# EAGLE schematic cs_v1 (EAGLE 9.5.0)

## Sheet 1 of 4
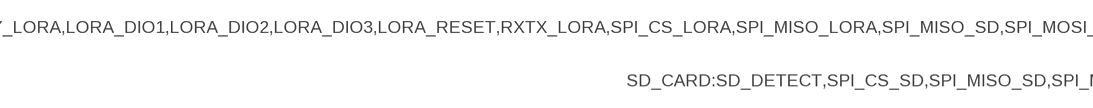
[diagram p0: schematic, sheet 1, part 1 of 2]
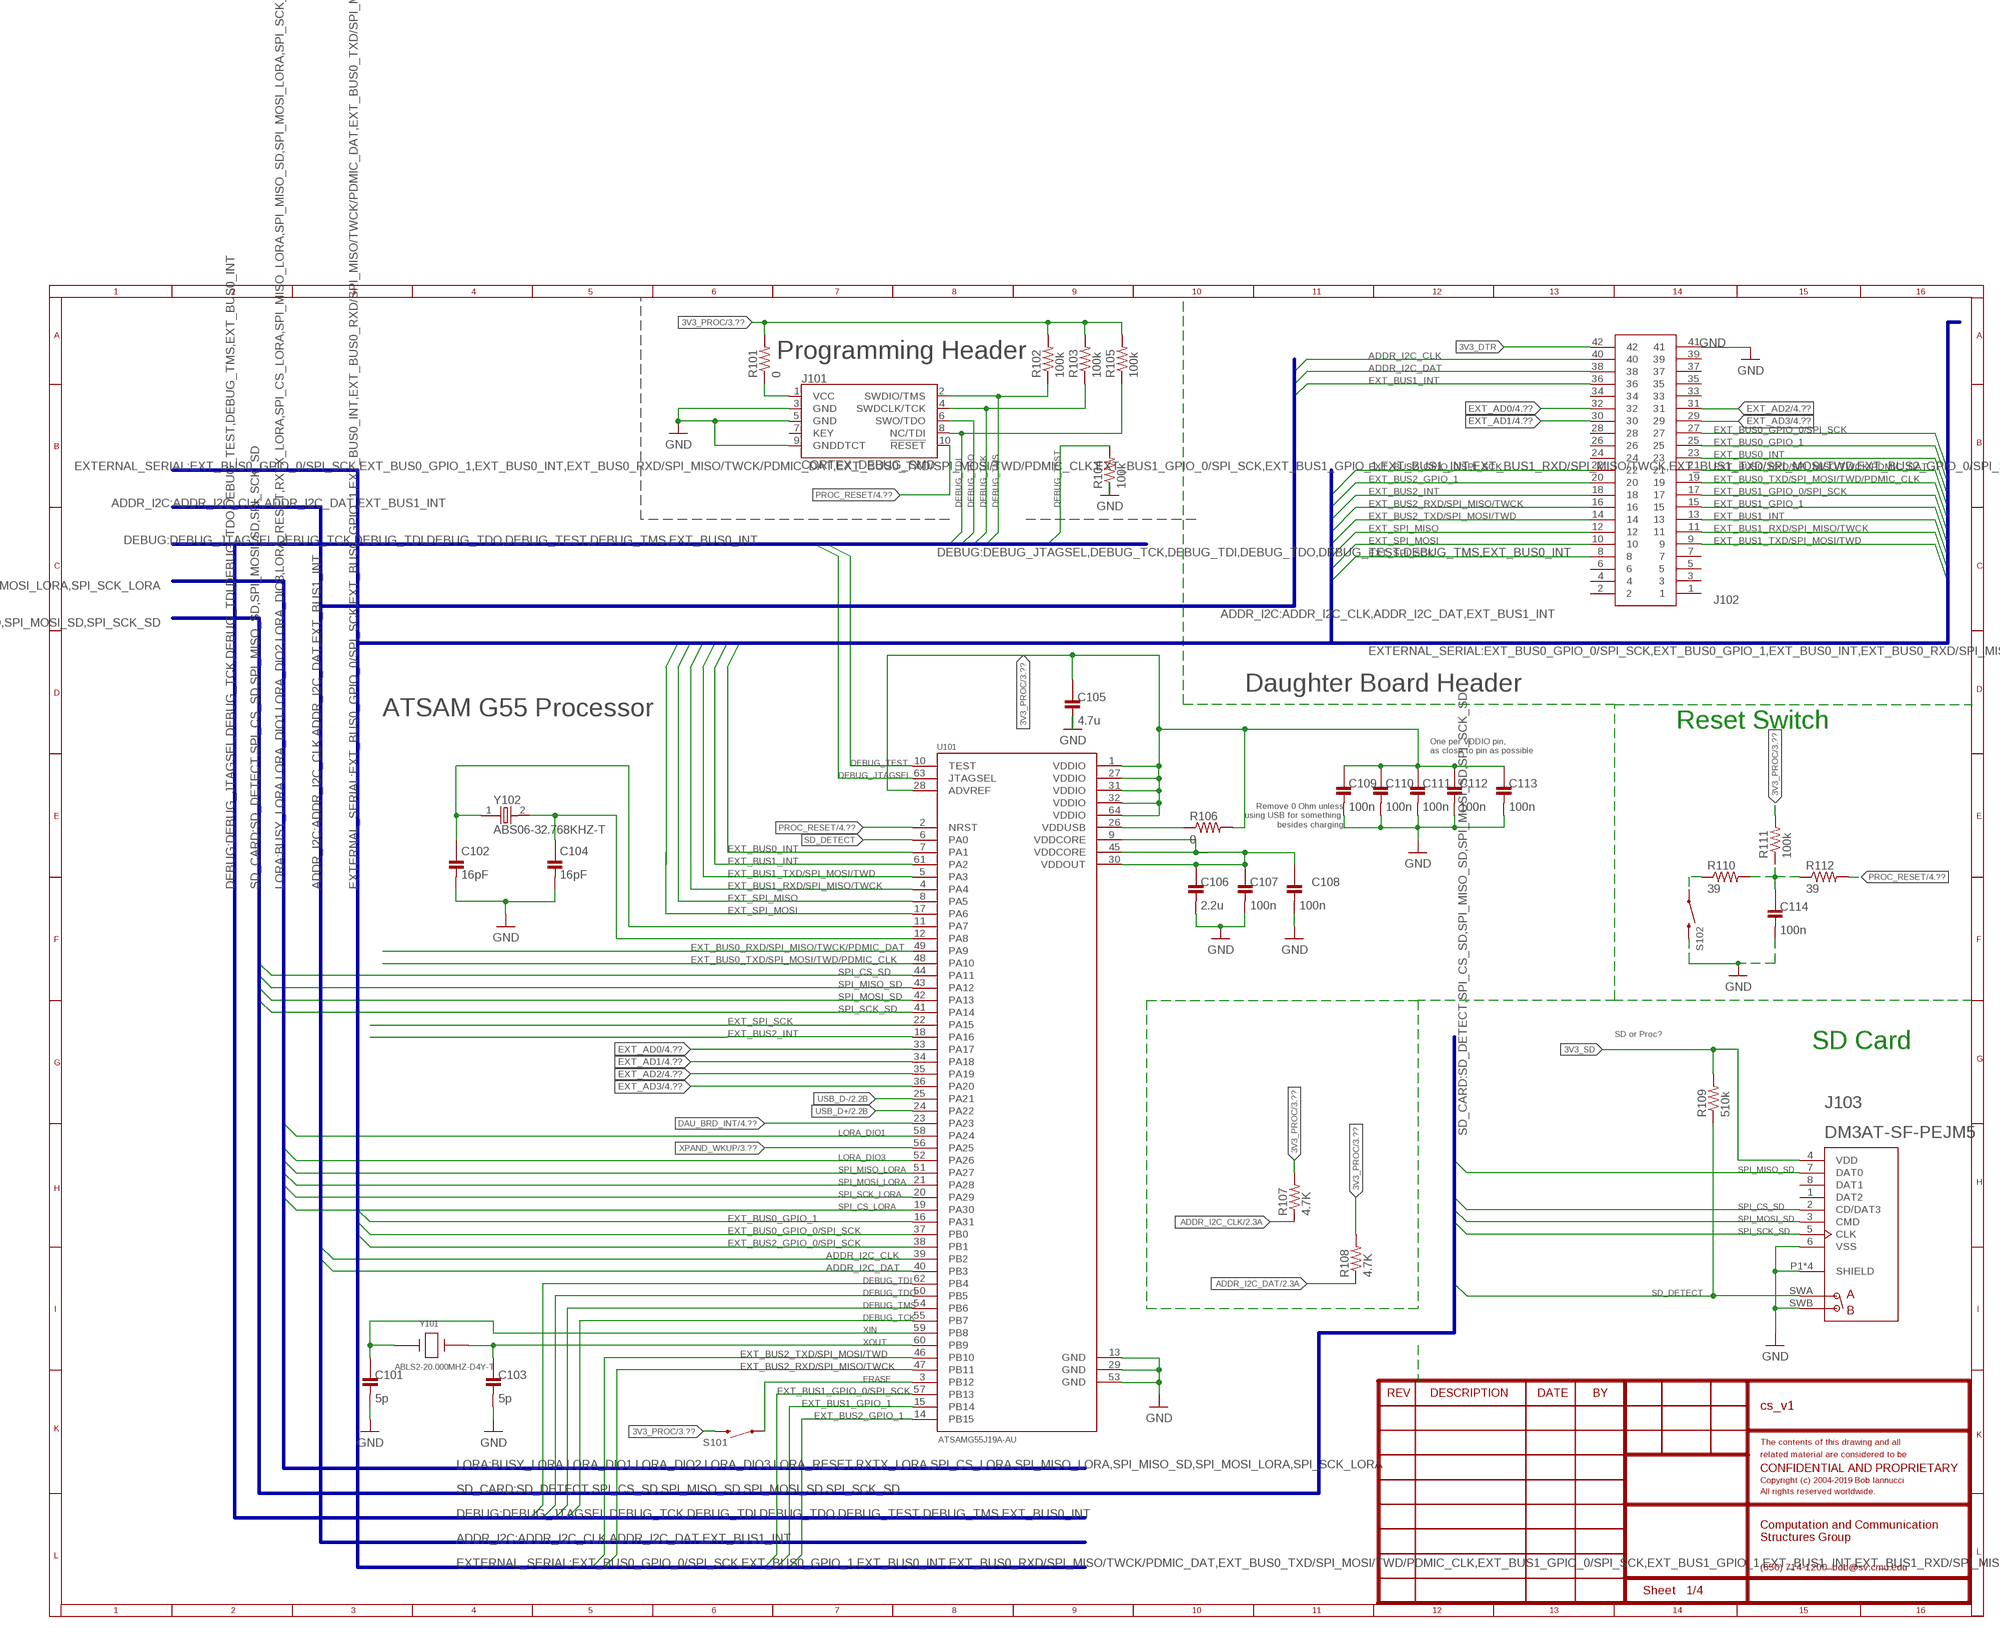
[diagram p1: schematic, sheet 1, part 2 of 2]

### Parts
C101  5p  C-0402  [C0402]
C102  16pF  C-0402  [C0402]
C103  5p  C-0402  [C0402]
C104  16pF  C-0402  [C0402]
C105  4.7u  C-0402  [C0402]
C106  2.2u  C-0402  [C0402]
C107  100n  C-0402  [C0402]
C108  100n  C-0402  [C0402]
C109  100n  C-0402  [C0402]
C110  100n  C-0402  [C0402]
C111  100n  C-0402  [C0402]
C112  100n  C-0402  [C0402]
C113  100n  C-0402  [C0402]
C114  100n  C-0402  [C0402]
J101  CORTEX_DEBUG_SMD  [SAMTECH_FTSH-105-01]
J102  HIROSE-DF17(4.0)-40DS-0.5V(57)  [DF174040DS05V57_1]
J103  DM3AT-SF-PEJM5  [HRS_DM3AT-SF-PEJM5]
R101  0  0OHM-0603-1/10W  [0603]
R102  100k  R-0402  [R0402]
R103  100k  R-0402  [R0402]
R104  100k  R-0402  [R0402]
R105  100k  R-0402  [R0402]
R106  0  0OHM-0603-1/10W  [0603]
R107  4.7K  R-0402  [R0402]
R108  4.7K  R-0402  [R0402]
R109  510k  R-0402  [R0402]
R110  39  R-0402  [R0402]
R111  100k  R-0402  [R0402]
R112  39  R-0402  [R0402]
S101  MOMENTARY-SWITCH-SPST-SMD-5.2-REDUNDANT  [TACTILE_SWITCH_SMD_5.2MM]
S102  MOMENTARY-SWITCH-SPST-SMD-5.2-REDUNDANT  [TACTILE_SWITCH_SMD_5.2MM]
U101  ATSAMG55J19A-AU  [QFP50P1200X1200X160-64N]
Y101  ABLS2-20.000MHZ-D4Y-T  [XTAL_ABLS2-20.000MHZ-D4Y-T]
Y102  ABS06-32.768KHZ-T  [XTAL_ABS06-32.768KHZ-T]

### Nets
3V3_DTR [power_3v3]: J102.42 ; also sheet 2,4
3V3_PROC [power_3v3]: C105.1 C109.1 C110.1 C111.1 C112.1 C113.1 R101.2 R102.2 R103.2 R105.2 R106.2 R107.2 R108.2 R111.2 S101.3 S101.4 U101.1(VDDIO) U101.27(VDDIO) U101.28(ADVREF) U101.31(VDDIO) U101.32(VDDIO) U101.64(VDDIO) ; also sheet 2,3,4
3V3_SD [power_3v3]: J103.4(VDD) R109.2 ; also sheet 2,4
ADDR_I2C_CLK: J102.40 R107.1 U101.39(PB2) ; also sheet 2,3,4
ADDR_I2C_DAT: J102.38 R108.1 U101.40(PB3) ; also sheet 2,3,4
DAU_BRD_INT: U101.23(PA23) ; also sheet 4
DEBUG_JTAGSEL: U101.63(JTAGSEL)
DEBUG_TCK: J101.4(SWDCLK/TCK) R103.1 U101.55(PB7)
DEBUG_TDI: J101.8(NC/TDI) R105.1 U101.62(PB4)
DEBUG_TDO: J101.6(SWO/TDO) U101.50(PB5)
DEBUG_TEST: R104.2 U101.10(TEST)
DEBUG_TMS: J101.2(SWDIO/TMS) R102.1 U101.54(PB6)
ERASE: S101.1 S101.2 U101.3(PB12)
EXT_AD0: J102.32 U101.33(PA17) ; also sheet 4
EXT_AD1: J102.30 U101.34(PA18) ; also sheet 4
EXT_AD2: J102.31 U101.35(PA19) ; also sheet 4
EXT_AD3: J102.29 U101.36(PA20) ; also sheet 4
EXT_BUS0_GPIO_0/SPI_SCK: J102.27 U101.37(PB0) ; also sheet 4
EXT_BUS0_GPIO_1: J102.25 U101.16(PA31) ; also sheet 4
EXT_BUS0_INT: J102.23 U101.7(PA1) ; also sheet 4
EXT_BUS0_RXD/SPI_MISO/TWCK/PDMIC_DAT: J102.21 U101.49(PA9) ; also sheet 4
EXT_BUS0_TXD/SPI_MOSI/TWD/PDMIC_CLK: J102.19 U101.48(PA10) ; also sheet 4
EXT_BUS1_GPIO_0/SPI_SCK: J102.17 U101.57(PB13) ; also sheet 4
EXT_BUS1_GPIO_1: J102.15 U101.15(PB14) ; also sheet 4
EXT_BUS1_INT: J102.13 J102.36 U101.61(PA2) ; also sheet 4
EXT_BUS1_RXD/SPI_MISO/TWCK: J102.11 U101.4(PA4) ; also sheet 4
EXT_BUS1_TXD/SPI_MOSI/TWD: J102.9 U101.5(PA3) ; also sheet 4
EXT_BUS2_GPIO_0/SPI_SCK: J102.22 U101.38(PB1) ; also sheet 4
EXT_BUS2_GPIO_1: J102.20 U101.14(PB15) ; also sheet 4
EXT_BUS2_INT: J102.18 U101.18(PA16) ; also sheet 4
EXT_BUS2_RXD/SPI_MISO/TWCK: J102.16 U101.47(PB11) ; also sheet 4
EXT_BUS2_TXD/SPI_MOSI/TWD: J102.14 U101.46(PB10) ; also sheet 4
EXT_SPI_MISO: J102.12 U101.8(PA5) ; also sheet 4
EXT_SPI_MOSI: J102.10 U101.17(PA6) ; also sheet 4
EXT_SPI_SCK: J102.8 U101.22(PA15) ; also sheet 4
GND [10_mil]: C101.2 C102.2 C103.2 C104.2 C105.2 C106.2 C107.2 C108.2 C109.2 C110.2 C111.2 C112.2 C113.2 C114.2 J101.3(GND) J101.5(GND) J101.9(GNDDTCT) J102.41 J103.6(VSS) J103.P1(SHIELD) J103.P2(SHIELD) J103.P3(SHIELD) J103.P4(SHIELD) J103.SWB(B) R104.1 S102.3 S102.4 U101.13(GND) U101.29(GND) U101.53(GND) ; also sheet 2,3,4
LORA_DIO1: U101.58(PA24) ; also sheet 3,4
LORA_DIO3: U101.52(PA26) ; also sheet 3,4
N$4: J101.1(VCC) R101.1
PROC_RESET: J101.10(!RESET) R112.2 U101.2(NRST) ; also sheet 4
RESET_SW_1: C114.1 R110.2 R111.1 R112.1
RESET_SW_2: R110.1 S102.1 S102.2
SD_DETECT: J103.SWA(A) R109.1 U101.6(PA0) ; also sheet 4
SPI_CS_LORA: U101.19(PA30) ; also sheet 3,4
SPI_CS_SD: J103.2(CD/DAT3) U101.44(PA11) ; also sheet 4
SPI_MISO_LORA: U101.51(PA27) ; also sheet 3,4
SPI_MISO_SD: J103.7(DAT0) U101.43(PA12) ; also sheet 4
SPI_MOSI_LORA: U101.21(PA28) ; also sheet 3,4
SPI_MOSI_SD: J103.3(CMD) U101.42(PA13) ; also sheet 4
SPI_SCK_LORA: U101.20(PA29) ; also sheet 3,4
SPI_SCK_SD: J103.5(CLK) U101.41(PA14) ; also sheet 4
USB_D+: U101.24(PA22) ; also sheet 2,4
USB_D-: U101.25(PA21) ; also sheet 2,4
VDDOUT [power_3v3]: C106.1 C107.1 C108.1 U101.9(VDDCORE) U101.30(VDDOUT) U101.45(VDDCORE)
VDDUSB [power_3v3]: R106.1 U101.26(VDDUSB)
XIN: C101.1 U101.59(PB8) Y101.1
XIN32: C102.1 U101.11(PA7) Y102.1
XOUT: C103.1 U101.60(PB9) Y101.2
XOUT32: C104.1 U101.12(PA8) Y102.2
XPAND_WKUP: U101.56(PA25) ; also sheet 3,4
Unconnected: J101.7(KEY) J102.1 J102.2 J102.3 J102.4 J102.5 J102.6 J102.7 J102.24 J102.26 J102.28 J102.33 J102.34 J102.35 J102.37 J102.39 J103.1(DAT2) J103.8(DAT1)

### Buses
SD_CARD:SD_DETECT,SPI_CS_SD,SPI_MISO_SD,SPI_MOSI_SD,SPI_SCK_SD
LORA:BUSY_LORA,LORA_DIO1,LORA_DIO2,LORA_DIO3,LORA_RESET,RXTX_LORA,SPI_CS_LORA,SPI_MISO_LORA,SPI_MISO_SD,SPI_MOSI_LORA,SPI_SCK_LORA
DEBUG:DEBUG_JTAGSEL,DEBUG_TCK,DEBUG_TDI,DEBUG_TDO,DEBUG_TEST,DEBUG_TMS,EXT_BUS0_INT
EXTERNAL_SERIAL:EXT_BUS0_GPIO_0/SPI_SCK,EXT_BUS0_GPIO_1,EXT_BUS0_INT,EXT_BUS0_RXD/SPI_MISO/TWCK/PDMIC_DAT,EXT_BUS0_TXD/SPI_MOSI/TWD/PDMIC_CLK,EXT_BUS1_GPIO_0/SPI_SCK,EXT_BUS1_GPIO_1,EXT_BUS1_INT,EXT_BUS1_RXD/SPI_MISO/TWCK,EXT_BUS1_TXD/SPI_MOSI/TWD,EXT_BUS2_GPIO_0/SPI_SCK,EXT_BUS2_GPIO_1,EXT_BUS2_INT,EXT_BUS2_RXD/SPI_MISO/TWCK,EXT_BUS2_TXD/SPI_MOSI/TWD,EXT_SPI_MISO,EXT_SPI_MOSI,EXT_SPI_SCK
ADDR_I2C:ADDR_I2C_CLK,ADDR_I2C_DAT,EXT_BUS1_INT

### Notes on the sheet
- Programming Header
- Daughter Board Header
- ATSAM G55 Processor
- Reset Switch
- One per VDDIO pin, 
  as close to pin as possible
- Remove 0 Ohm unless
  using USB for something 
  besides charging
- SD or Proc?
- SD Card

## Sheet 2 of 4
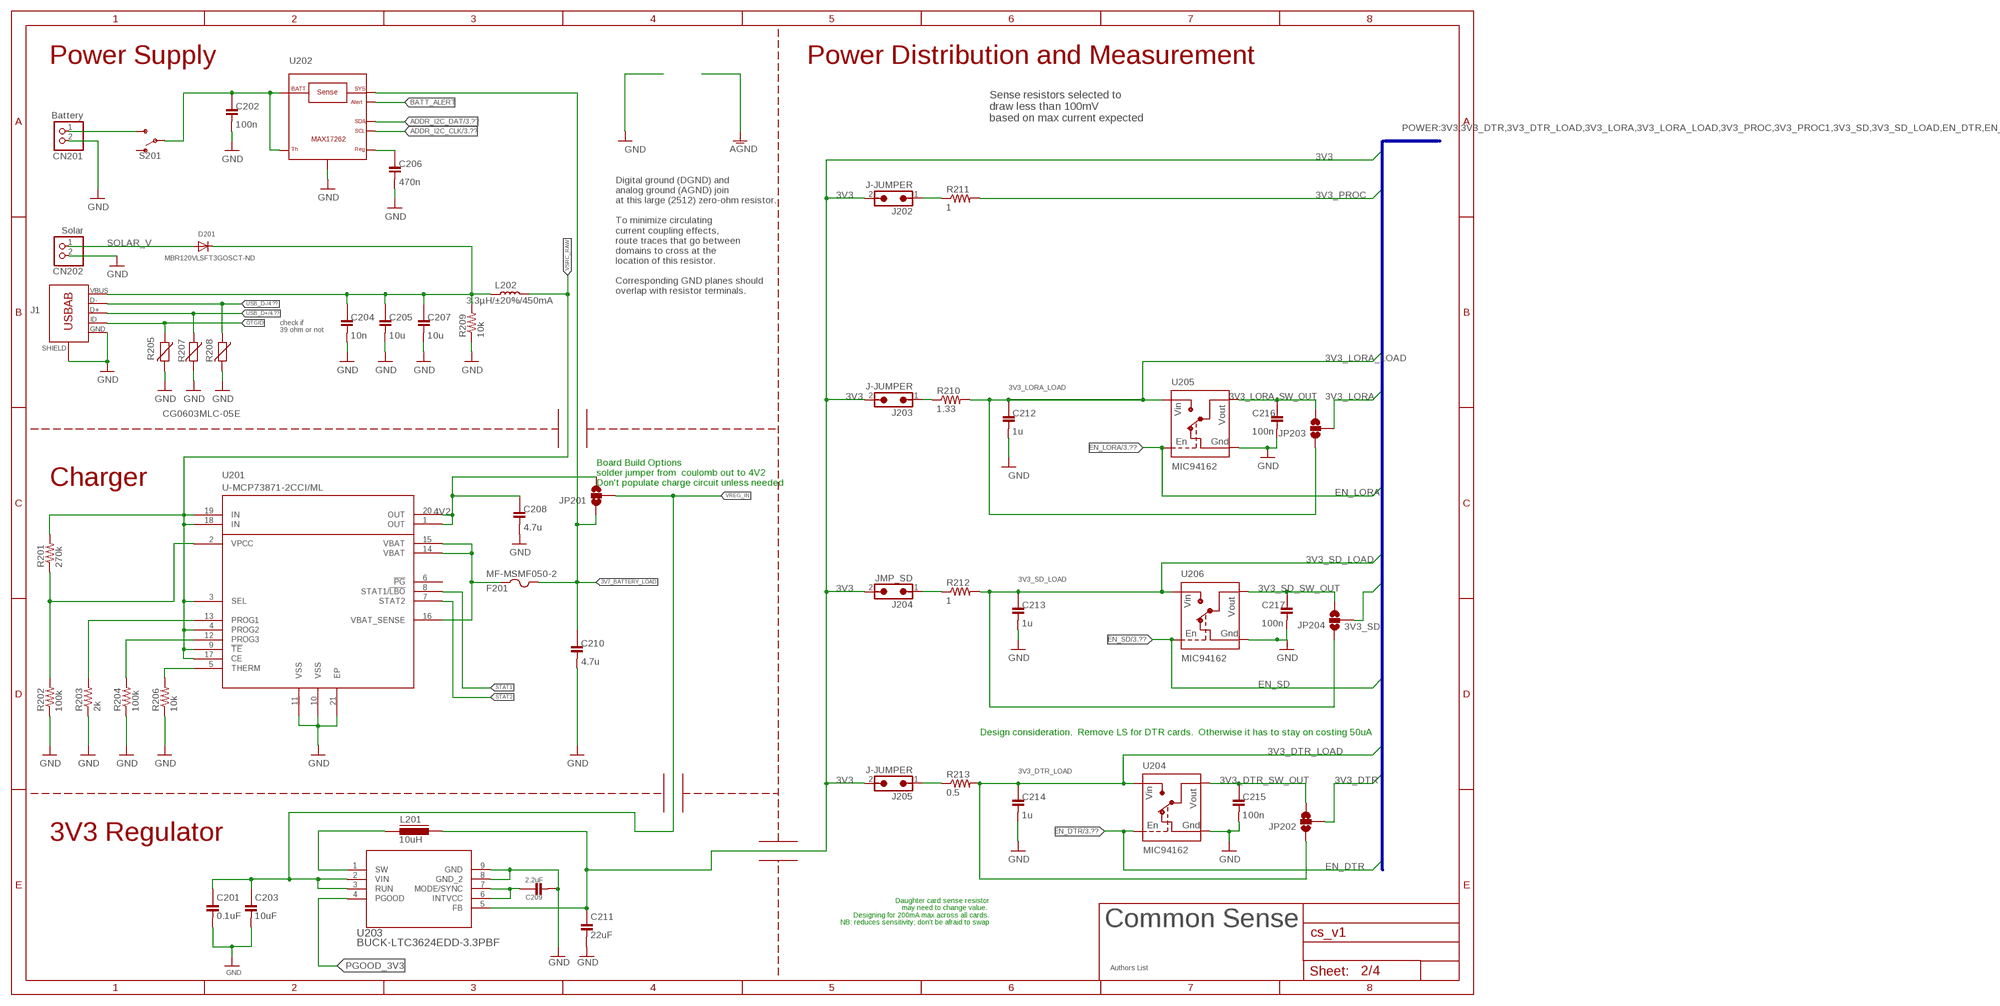
[diagram p2: schematic, sheet 2]

### Parts
C201  0.1uF  C-0603  [C0603]
C202  100n  C-0402  [C0402]
C203  10uF  C-0805  [C0805]
C204  10n  C-0402  [C0402]
C205  10u  C-0402  [C0402]
C206  470n  C-0402  [C0402]
C207  10u  C-0402  [C0402]
C208  4.7u  C-0402  [C0402]
C209  2.2uF  C-0805  [C0805]
C210  4.7u  C-0402  [C0402]
C211  22uF  C-0805  [C0805]
C212  1u  C-0402  [C0402]
C213  1u  C-0402  [C0402]
C214  1u  C-0402  [C0402]
C215  100n  C-0402  [C0402]
C216  100n  C-0402  [C0402]
C217  100n  C-0402  [C0402]
CN201  Battery  JST_2PIN-THM-RA  [JST-PH-2-THM-RA]
CN202  Solar  JST_2PIN-THM-RA  [JST-PH-2-THM-RA]
D201  MBR120VLSFT3GOSCT-ND  DIODESOD-123  [SOD-123]
F201  MF-MSMF050-2  PTCFUSE-1812  [1812]
J201  USBABSMTDIP  [ZX62D-AB-5P8]
J202  J-JUMPER  [HEADER-1X2]
J203  J-JUMPER  [HEADER-1X2]
J204  JMP_SD  J-JUMPER  [HEADER-1X2]
J205  J-JUMPER  [HEADER-1X2]
JP201  JMP_CHRG  JUMPER-SMT_3_NO_NO-SILK  [SMT-JUMPER_3_NO_NO-SILK]
JP202  JMP_DTR  JUMPER-SMT_3_NO_NO-SILK  [SMT-JUMPER_3_NO_NO-SILK]
JP203  JMP_LORA  JUMPER-SMT_3_NO_NO-SILK  [SMT-JUMPER_3_NO_NO-SILK]
JP204  JMP_SD  JUMPER-SMT_3_NO_NO-SILK  [SMT-JUMPER_3_NO_NO-SILK]
L201  10uH  L-FE-5X5SMD  [L-5X5SMD]
L202  3.3µH/±20%/450mA  INDUCTOR-0805-3.3UH  [0805]
R201  270k  R-0402  [R0402]
R202  100k  R-0402  [R0402]
R203  2k  R-0402  [R0402]
R204  100k  R-0402  [R0402]
R205  CG0603MLC-05E  VARISTORCN0603  [CT/CN0603]
R206  10k  R-0402  [R0402]
R207  CG0603MLC-05E  VARISTORCN0603  [CT/CN0603]
R208  CG0603MLC-05E  VARISTORCN0603  [CT/CN0603]
R209  10k  R-0402  [R0402]
R210  1.33  R-0603  [R0603]
R211  1  R-0603  [R0603]
R212  1  R-0603  [R0603]
R213  0.5  R-0603  [R0603]
S201  SWITCH-SPDT-SMD-RIGHT-ANGLE  [SWITCH_SPST_SMD_A]
U201  U-MCP73871-2CCI/ML  [QFN20_4X4MC]
U202  COULOMB-MAX17262  [BGA9N40P3X3_144X146X69N]
U203  BUCK-LTC3624EDD-3.3PBF  [DFN-8_DD]
U204  LOADSWITCH-MIC94162  [WLCSP6_2X3]
U205  LOADSWITCH-MIC94162  [WLCSP6_2X3]
U206  LOADSWITCH-MIC94162  [WLCSP6_2X3]

### Nets
3V3 [power_3v3]: C211.1 J202.2 J203.2 J204.2 J205.2 L201.2 U203.5(FB) ; also sheet 4
3V3_DTR [power_3v3]: JP202.2 ; also sheet 1,4
3V3_DTR_LOAD [power_3v3]: C214.1 JP202.1 R213.2 U204.A2(VIN) U204.B2(VIN) ; also sheet 4
3V3_DTR_SW_OUT [power_3v3]: C215.1 JP202.3 U204.A1(VOUT) U204.B1(VOUT)
3V3_LORA [power_3v3]: JP203.2 ; also sheet 3,4
3V3_LORA_LOAD [power_3v3]: C212.1 JP203.1 R210.2 U205.A2(VIN) U205.B2(VIN) ; also sheet 4
3V3_LORA_SW_OUT [power_3v3]: C216.1 JP203.3 U205.A1(VOUT) U205.B1(VOUT)
3V3_PROC [power_3v3]: R211.2 ; also sheet 1,3,4
3V3_SD [power_3v3]: JP204.2 ; also sheet 1,4
3V3_SD_LOAD [power_3v3]: C213.1 JP204.1 R212.2 U206.A2(VIN) U206.B2(VIN) ; also sheet 4
3V3_SD_SW_OUT [power_3v3]: C217.1 JP204.3 U206.A1(VOUT) U206.B1(VOUT)
3V7_BATTERY [power_3v3]: C202.1 S201.2(P) U202.A1(TH) U202.A2(BATT)
3V7_BATTERY_LOAD [power_3v3]: C210.1 F201.2 JP201.1 U202.B3(SYS)
4V2 [power_5]: C208.1 JP201.3 U201.1(OUT) U201.20(OUT)
ADDR_I2C_CLK: U202.B1(SCL) ; also sheet 1,3,4
ADDR_I2C_DAT: U202.C1(SDA) ; also sheet 1,3,4
BAT_CHG_PROG1: R203.2 U201.13(PROG1)
BATT_ALERT: U202.B2(ALRT)
BATT_IN [power_3v3]: CN201.1 S201.3(S)
CHG_VPCC [power_3v3]: R201.1 R202.2 U201.2(VPCC)
DTR_JMP [power_3v3]: J205.1 R213.1
EN_DTR: U204.C2(ENABLE) ; also sheet 3,4
EN_LORA: U205.C2(ENABLE) ; also sheet 3,4
EN_SD: U206.C2(ENABLE) ; also sheet 3,4
GND [10_mil]: C201.2 C202.2 C203.2 C204.2 C205.2 C206.2 C207.2 C208.2 C209.2 C210.2 C211.2 C212.2 C213.2 C214.2 C215.2 C216.2 C217.2 CN201.2 CN202.2 J201.GND J201.S1(SHIELD) J201.S2(SHIELD) J201.S3(SHIELD) J201.S4(SHIELD) R202.1 R203.1 R204.1 R205.2 R206.1 R207.2 R208.2 R209.1 U201.10(VSS) U201.11(VSS) U201.21(EP) U202.C3(GND) U203.8(GND_2) U203.9(GND) U204.C1(GND) U205.C1(GND) U206.C1(GND) ; also sheet 1,3,4
LORA_JMP [power_3v3]: J203.1 R210.1
N$2 [power_3v3]: L201.1 U203.1(SW)
N$8: C209.1 U203.6(INTVCC) U203.7(MODE/SYNC)
N$10: R204.2 U201.12(PROG3)
N$13: C206.1 U202.C2(REG)
OTGID: J201.USBID R205.1
PGOOD_3V3: U203.4(PGOOD)
PROC_JMP [power_3v3]: J202.1 R211.1
SD_JMP [power_3v3]: J204.1 R212.1
SOLAR_V [power_3v3]: CN202.1 D201.A
STAT1: U201.8(STAT1/!LBO)
STAT2: U201.7(STAT2)
THERM: R206.2 U201.5(THERM)
USB_D+: J201.D+ R207.1 ; also sheet 1,4
USB_D-: J201.D- R208.1 ; also sheet 1,4
USB_VBUS [power_3v3]: C204.1 C205.1 C207.1 D201.C J201.VBUS L202.1 R209.2
VBAT [power_3v3]: F201.1 U201.14(VBAT) U201.15(VBAT) U201.16(VBAT_SENSE)
VREG_IN [power_5]: C201.1 C203.1 JP201.2 U203.2(VIN) U203.3(RUN)
VSRC_RAW [power_3v3]: L202.2 R201.2 U201.3(SEL) U201.4(PROG2) U201.9(!TE) U201.17(CE) U201.18(IN) U201.19(IN)
Unconnected: S201.1(O) U201.6(!PG)

### Buses
POWER:3V3,3V3_DTR,3V3_DTR_LOAD,3V3_LORA,3V3_LORA_LOAD,3V3_PROC,3V3_PROC1,3V3_SD,3V3_SD_LOAD,EN_DTR,EN_LORA,EN_SD

### Notes on the sheet
- Power Supply | Power Distribution and Measurement
- Sense resistors selected to
  draw less than 100mV 
  based on max current expected
- Digital ground (DGND) and
  analog ground (AGND) join
  at this large (2512) zero-ohm resistor.
  
  To minimize circulating 
  current coupling effects,
  route traces that go between
  domains to cross at the 
  location of this resistor.
  
  Corresponding GND planes should 
  overlap with resistor terminals.
- J1
- check if 
  39 ohm or not
- Charger
- Board Build Options
  solder jumper from  coulomb out to 4V2
  Don't populate charge circuit unless needed
- Design consideration.  Remove LS for DTR cards.  Otherwise it has to stay on costing 50uA
- 3V3 Regulator
- Daughter card sense resistor
  may need to change value. 
  Designing for 200mA max across all cards.
  NB: reduces sensitivity; don't be afraid to swap
- Common Sense
- Authors List

## Sheet 3 of 4
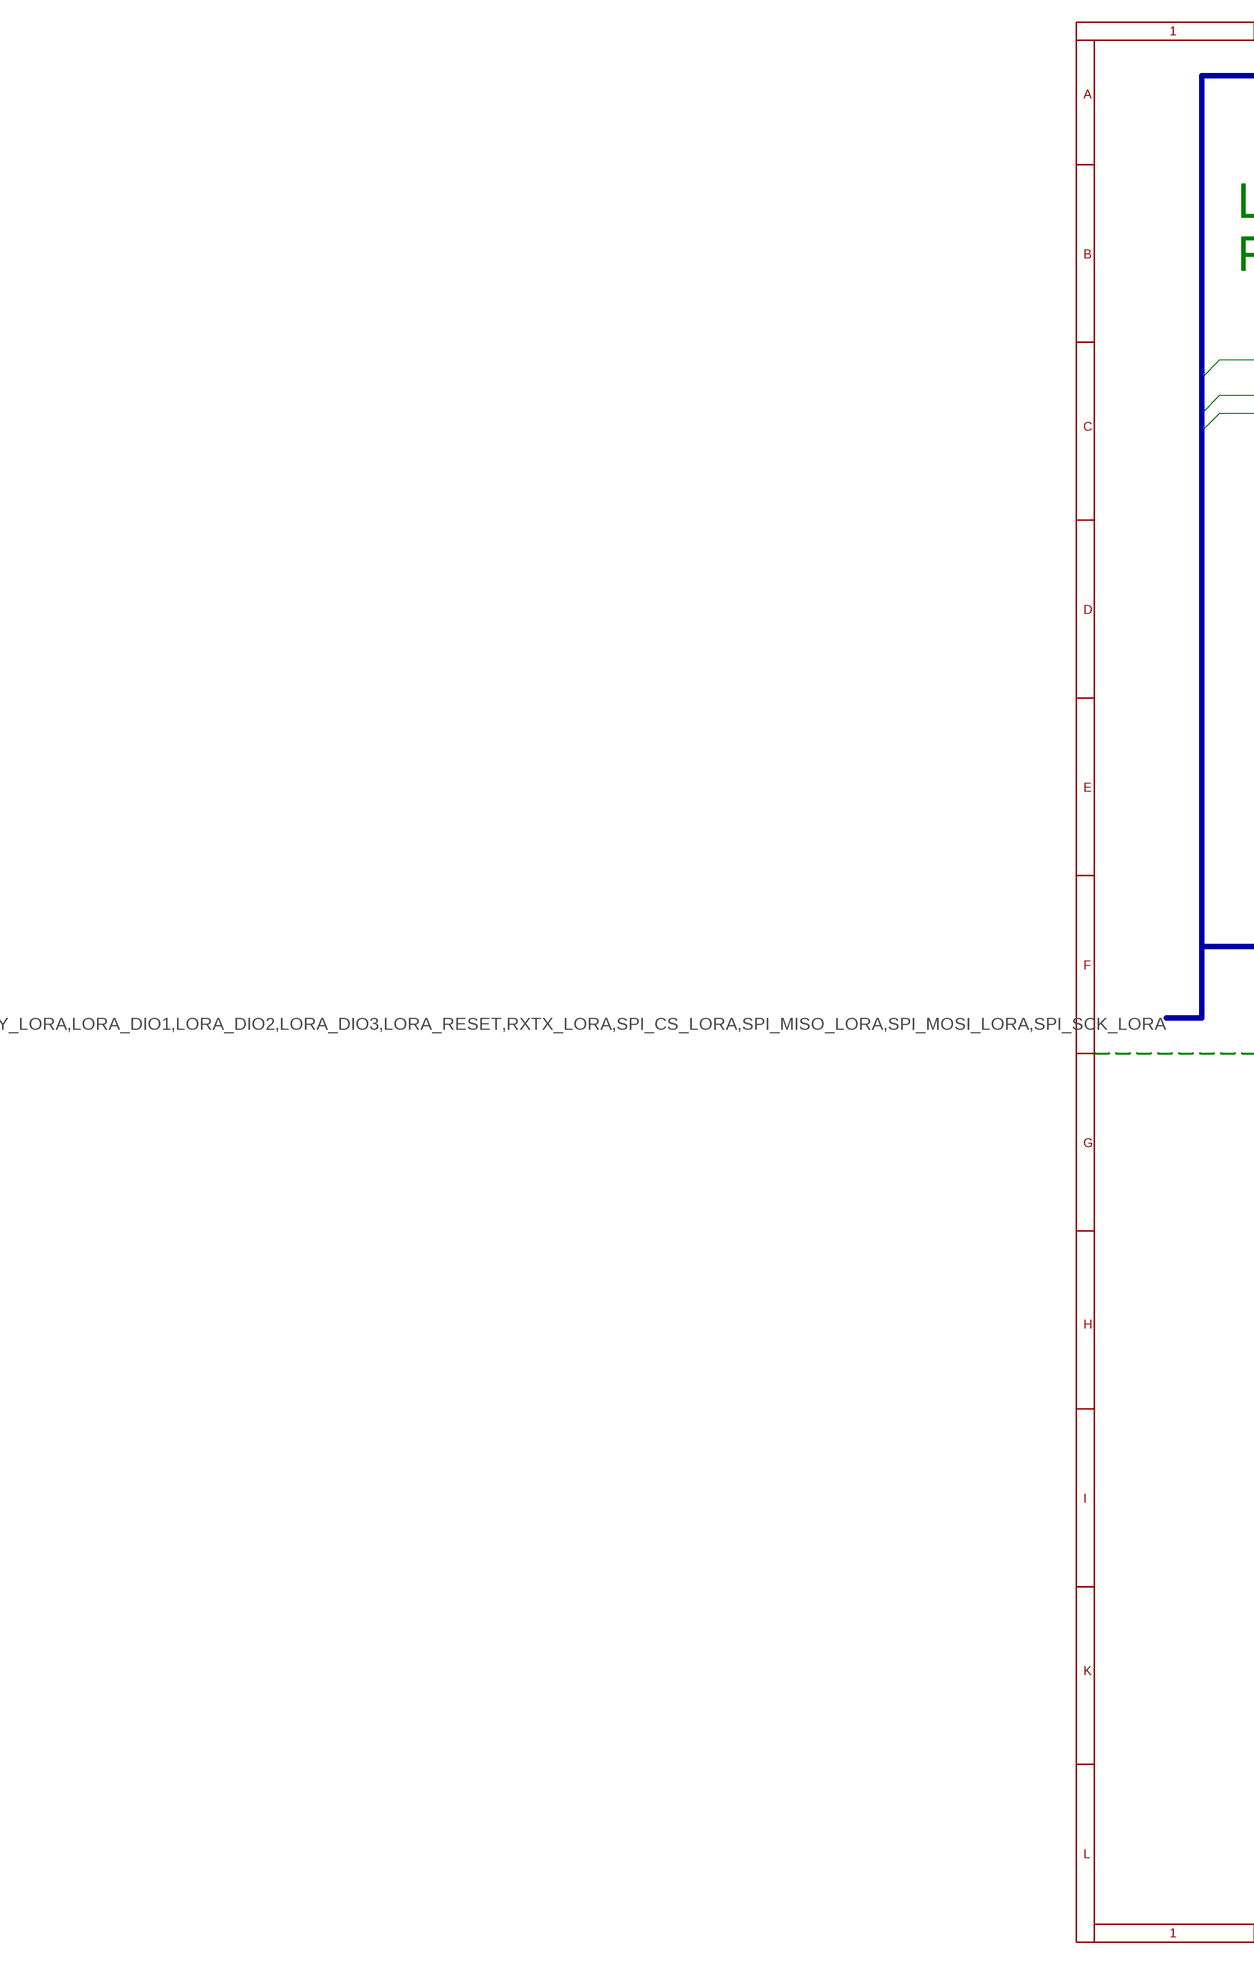
[diagram p3: schematic, sheet 3, part 1 of 2]
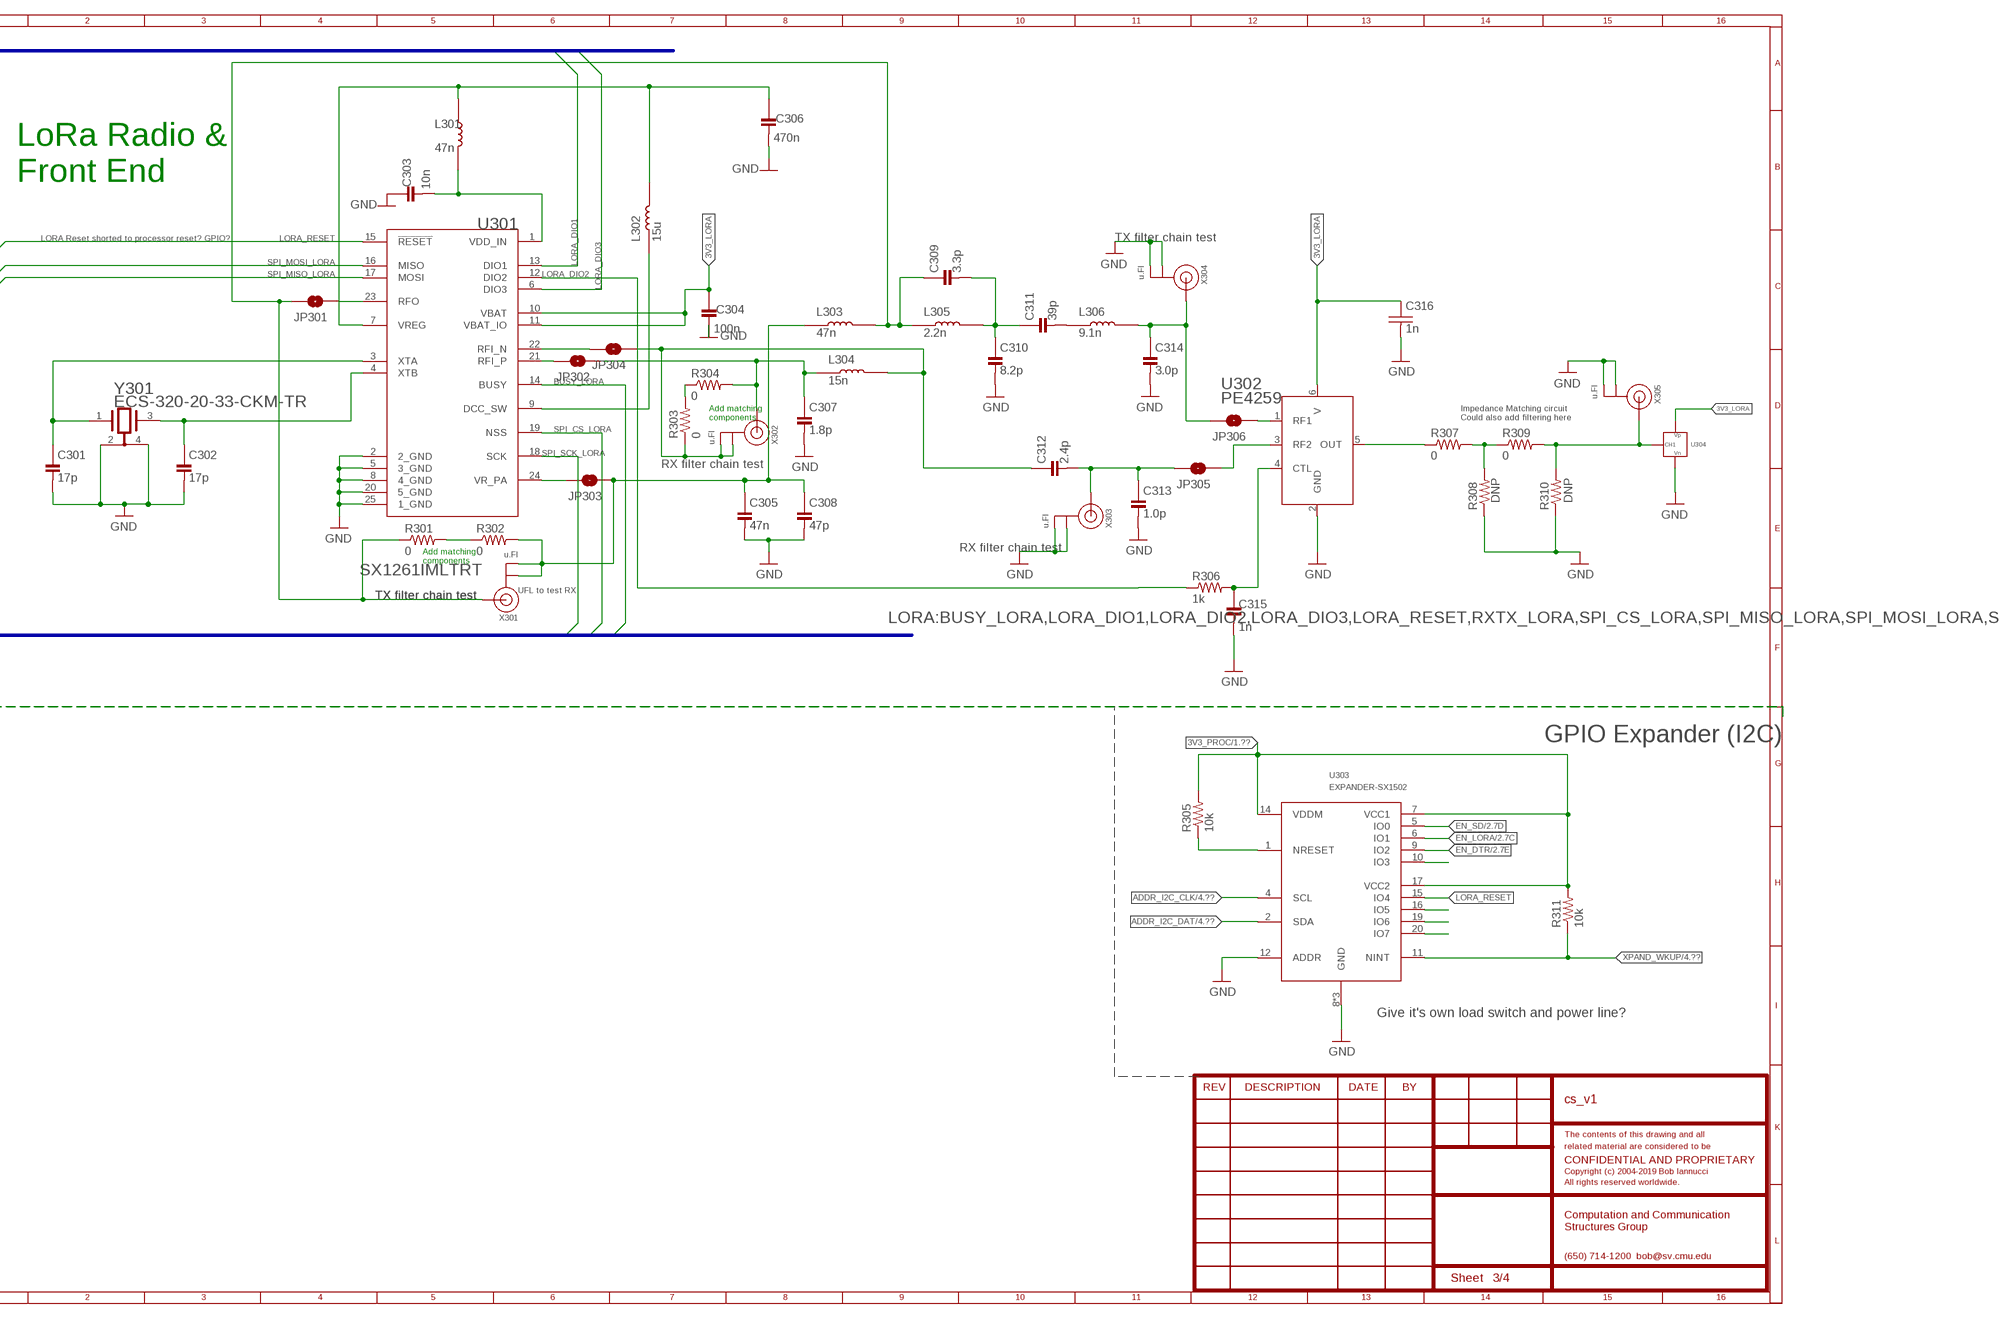
[diagram p4: schematic, sheet 3, part 2 of 2]

### Parts
C301  17p  C-0402  [C0402]
C302  17p  C-0402  [C0402]
C303  10n  C-0402  [C0402]
C304  100n  C-0402  [C0402]
C305  47n  C-0603  [C0603]
C306  470n  C-0402  [C0402]
C307  1.8p  C-0603  [C0603]
C308  47p  C-0603  [C0603]
C309  3.3p  C-0603  [C0603]
C310  8.2p  C-0603  [C0603]
C311  39p  C-0603  [C0603]
C312  2.4p  C-0603  [C0603]
C313  1.0p  C-0603  [C0603]
C314  3.0p  C-0603  [C0603]
C315  1n  C-0402  [C0402]
C316  1n  C-0402  [C0402]
JP301  JUMPER-SMT_2_NO_SILK  [SMT-JUMPER_2_NO_SILK]
JP302  JUMPER-SMT_2_NO_SILK  [SMT-JUMPER_2_NO_SILK]
JP303  JUMPER-SMT_2_NO_SILK  [SMT-JUMPER_2_NO_SILK]
JP304  JUMPER-SMT_2_NO_SILK  [SMT-JUMPER_2_NO_SILK]
JP305  JUMPER-SMT_2_NO_SILK  [SMT-JUMPER_2_NO_SILK]
JP306  JUMPER-SMT_2_NO_SILK  [SMT-JUMPER_2_NO_SILK]
L301  47n  L0402  [L0402]
L302  15u  MLZ2012N150LTD25  [INDC2012X87N]
L303  47n  L0603  [L0603]
L304  15n  L0603  [L0603]
L305  2.2n  L0603  [L0603]
L306  9.1n  L0603  [L0603]
R301  0  0OHM-0603-1/10W  [0603]
R302  0  0OHM-0603-1/10W  [0603]
R303  0  0OHM-0603-1/10W  [0603]
R304  0  0OHM-0603-1/10W  [0603]
R305  10k  R-0402  [R0402]
R306  1k  R-0402  [R0402]
R307  0  0OHM-0603-1/10W  [0603]
R308  0  0OHM-0603-1/10W  [0603]
R309  0  0OHM-0603-1/10W  [0603]
R310  0  0OHM-0603-1/10W  [0603]
R311  10k  R-0402  [R0402]
U301  SEMTECH_SX1261IMLTRTSEMTECH_SX1261IMLTRT_0_0  [SEMTECH_SX1261IMLTRT_0]
U302  PE4259  U-PE4259  [SC-70]
U303  EXPANDER-SX1502  [UQFN20]
U304  CM1213A-01SO  [SOT23-3]
X301  u.Fl  ANTENNA_U.FL  [U.FL]
X302  u.Fl  ANTENNA_U.FL  [U.FL]
X303  u.Fl  ANTENNA_U.FL  [U.FL]
X304  u.Fl  ANTENNA_U.FL  [U.FL]
X305  u.Fl  ANTENNA_U.FL  [U.FL]
Y301  ECS-32MHZ_CKM_XTAL  [ECS-32MHZ_CKM-TR_XTAL]

### Nets
3V3_LORA [power_3v3]: C304.1 C316.1 U301.10(VBAT) U301.11(VBAT_IO) U302.6(V) U304.2(VP) ; also sheet 2,4
3V3_PROC [power_3v3]: R305.2 R311.2 U303.7(VCC1) U303.14(VDDM) U303.17(VCC2) ; also sheet 1,2,4
ADDR_I2C_CLK: U303.4(SCL) ; also sheet 1,2,4
ADDR_I2C_DAT: U303.2(SDA) ; also sheet 1,2,4
BUSY_LORA: U301.14(BUSY)
EN_DTR: U303.9(IO2) ; also sheet 2,4
EN_LORA: U303.6(IO1) ; also sheet 2,4
EN_SD: U303.5(IO0) ; also sheet 2,4
GND [10_mil]: C301.2 C302.2 C303.1 C304.2 C305.2 C306.2 C307.2 C308.2 C310.2 C313.2 C314.2 C315.2 C316.2 R308.1 R310.1 U301.2(2_GND) U301.5(3_GND) U301.8(4_GND) U301.20(5_GND) U301.25(1_GND) U302.2(GND) U303.8(GND) U303.12(ADDR) U303.18(GND) U303.21(GND) U304.3(VN) X303.1(GND) X303.2(GND) X304.1(GND) X304.2(GND) X305.1(GND) X305.2(GND) Y301.2(1_GND) Y301.4(2_GND) ; also sheet 1,2,4
LORA_DCC_SW: L302.1 U301.9(DCC_SW)
LORA_DIO1: U301.13(DIO1) ; also sheet 1,4
LORA_DIO2: R306.1 U301.12(DIO2) ; also sheet 4
LORA_DIO3: U301.6(DIO3) ; also sheet 1,4
LORA_RESET: U301.15(!RESET!) U303.15(IO4) ; also sheet 4
LORA_RF [50_ohm]: R309.2 R310.2 U304.1(CH1) X305.3(SIGNAL)
LORA_RF2_1 [50_ohm]: R307.2 R308.2 R309.1
LORA_RF_SW [50_ohm]: R307.1 U302.5(OUT)
LORA_RFI_N: C312.1 JP304.1 L304.2 R303.1 X302.1(GND) X302.2(GND)
LORA_RFI_RX_SW: C312.2 C313.1 JP305.2 X303.3(SIGNAL)
LORA_RFO_4: C309.1 JP301.2 L303.2 L305.1 R301.1 X301.3(SIGNAL)
LORA_RFO_RX_SW: C314.1 JP306.2 L306.2 X304.3(SIGNAL)
LORA_RXTX_1: C315.1 R306.2 U302.4(CTL)
LORA_VREG: C306.1 L301.1 L302.2 U301.7(VREG)
LORA_XIN: C301.1 U301.3(XTA) Y301.1
LORA_XOUT: C302.1 U301.4(XTB) Y301.3
N$1: JP301.1 U301.23(RFO)
N$3: C309.2 C310.1 C311.1 L305.2
N$5: C311.2 L306.1
N$6: C307.1 JP302.1 L304.1 R304.2 X302.3(SIGNAL)
N$7: JP305.1 U302.3(RF2)
N$9: JP306.1 U302.1(RF1)
N$12: JP304.2 U301.22(RFI_N)
N$14: JP303.2 U301.24(VR_PA)
N$15: JP302.2 U301.21(RFI_P)
N$16: R303.2 R304.1
N$17: R301.2 R302.1
N$19: U303.10(IO3)
N$21: U303.16(IO5)
N$22: U303.19(IO6)
N$23: U303.20(IO7)
SPI_CS_LORA: U301.19(NSS) ; also sheet 1,4
SPI_MISO_LORA: U301.17(MOSI) ; also sheet 1,4
SPI_MOSI_LORA: U301.16(MISO) ; also sheet 1,4
SPI_SCK_LORA: U301.18(SCK) ; also sheet 1,4
VDD_LORA: C303.2 L301.2 U301.1(VDD_IN)
VR_PA1: C305.1 C308.1 JP303.1 L303.1 R302.2 X301.1(GND) X301.2(GND)
XPAND_RST: R305.1 U303.1(NRESET)
XPAND_WKUP: R311.1 U303.11(NINT) ; also sheet 1,4

### Buses
LORA:BUSY_LORA,LORA_DIO1,LORA_DIO2,LORA_DIO3,LORA_RESET,RXTX_LORA,SPI_CS_LORA,SPI_MISO_LORA,SPI_MOSI_LORA,SPI_SCK_LORA

### Notes on the sheet
- LoRa Radio &
  Front End
- LORA Reset shorted to processor reset? GPIO? | TX filter chain test
- Add matching 
  components
- Impedance Matching circuit
  Could also add filtering here
- RX filter chain test
- RX filter chain test
- Add matching 
  components
- UFL to test RX
- TX filter chain test | TX filter chain test
- GPIO Expander (I2C)
- Give it's own load switch and power line?

## Sheet 4 of 4
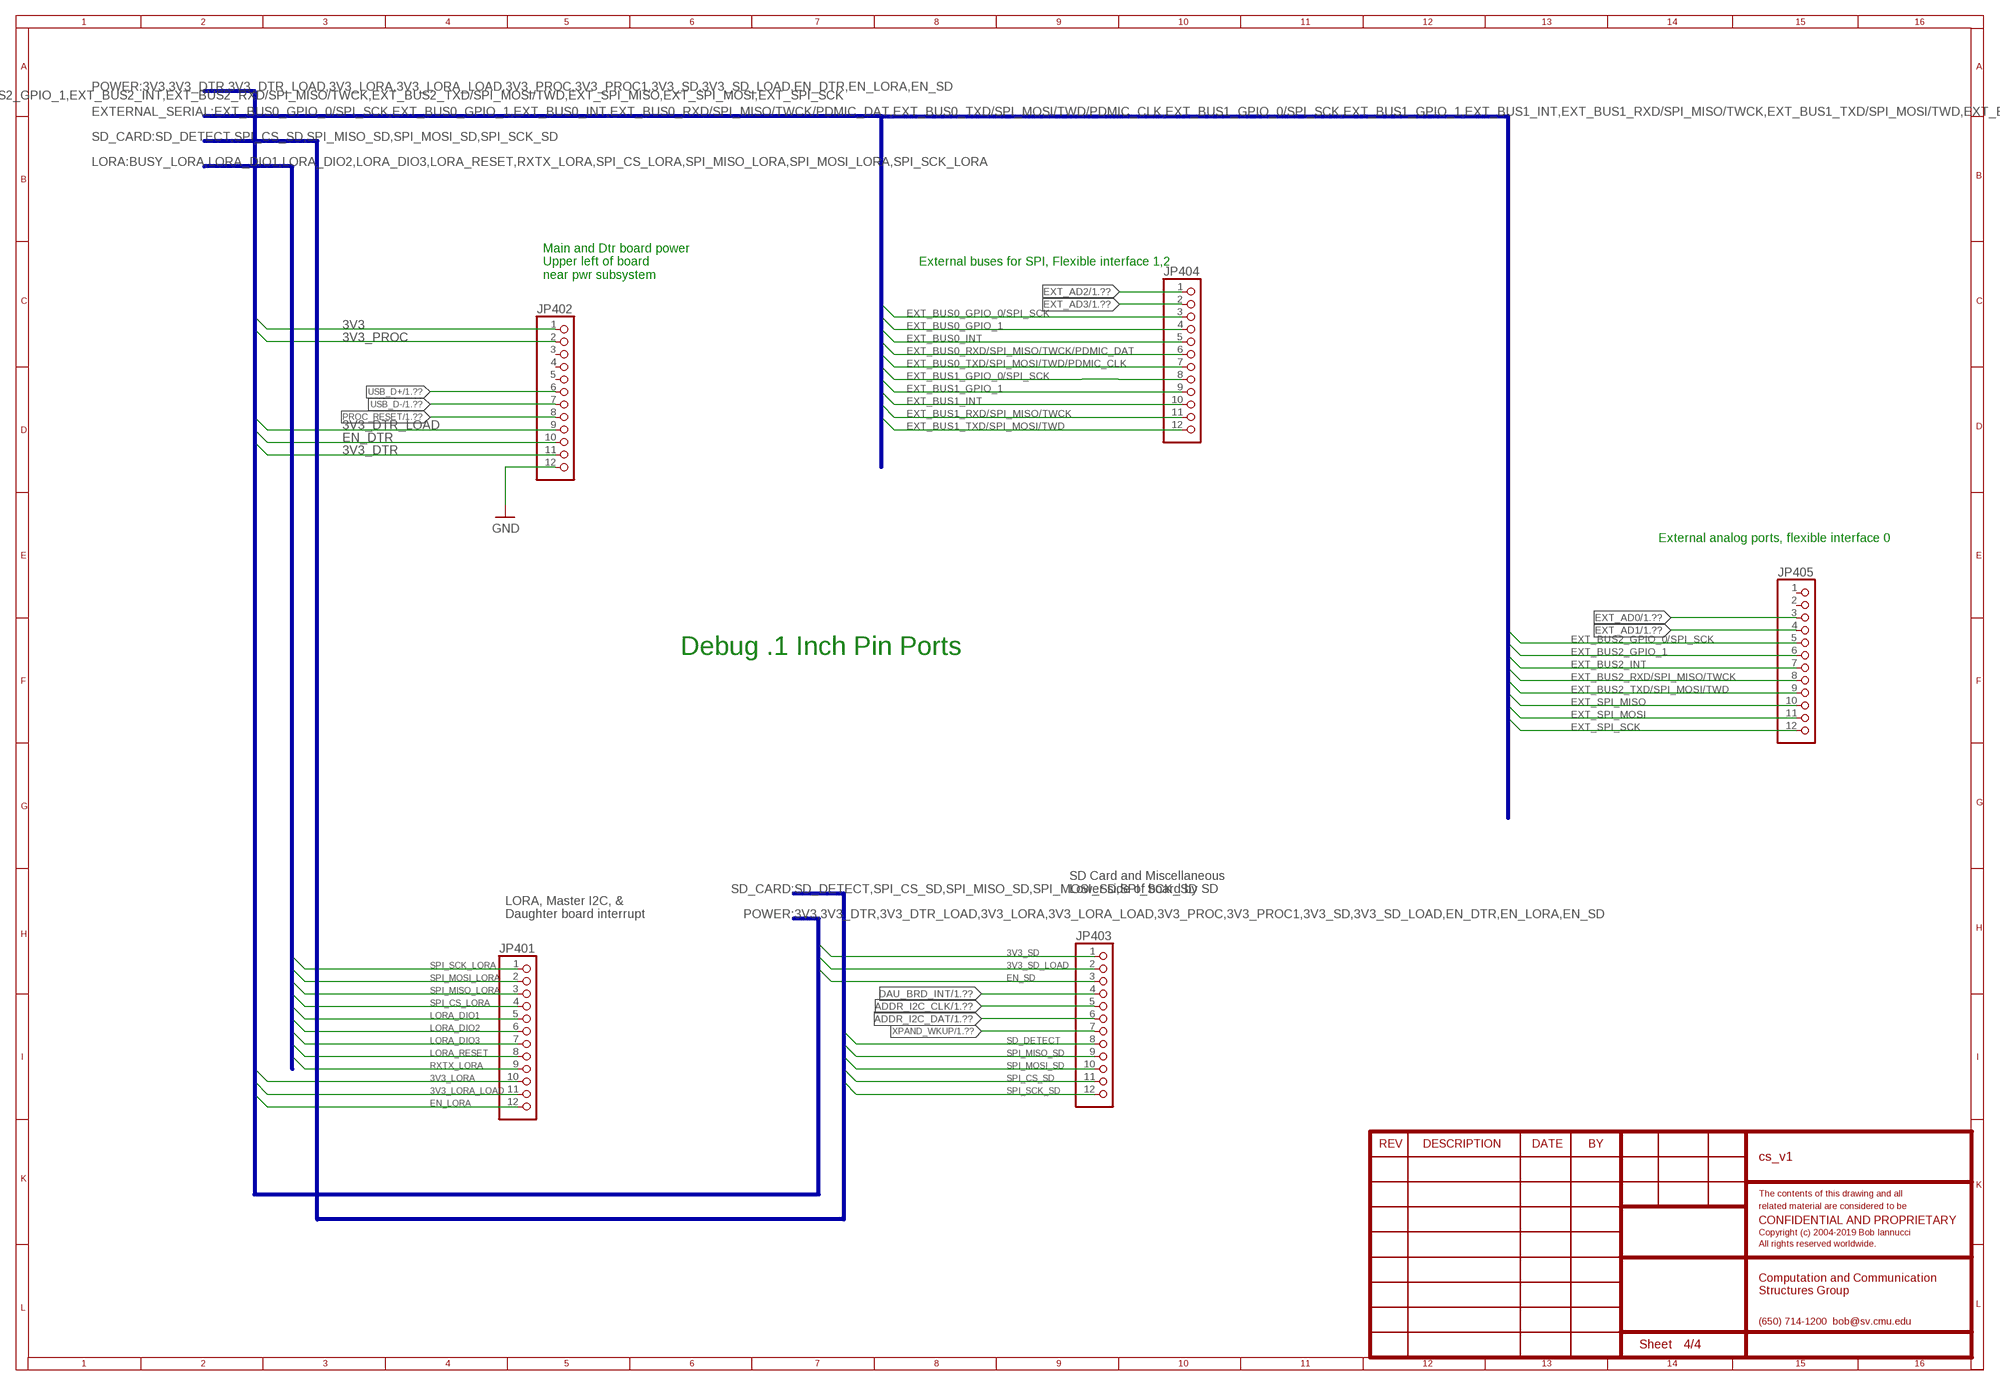
[diagram p5: schematic, sheet 4]

### Parts
JP401  J-HEADER-1X12  [1X12_ROUND]
JP402  J-HEADER-1X12  [1X12_ROUND]
JP403  J-HEADER-1X12  [1X12_ROUND]
JP404  J-HEADER-1X12  [1X12_ROUND]
JP405  J-HEADER-1X12  [1X12_ROUND]

### Nets
3V3 [power_3v3]: JP402.1 ; also sheet 2
3V3_DTR [power_3v3]: JP402.11 ; also sheet 1,2
3V3_DTR_LOAD [power_3v3]: JP402.9 ; also sheet 2
3V3_LORA [power_3v3]: JP401.10 ; also sheet 2,3
3V3_LORA_LOAD [power_3v3]: JP401.11 ; also sheet 2
3V3_PROC [power_3v3]: JP402.2 ; also sheet 1,2,3
3V3_SD [power_3v3]: JP403.1 ; also sheet 1,2
3V3_SD_LOAD [power_3v3]: JP403.2 ; also sheet 2
ADDR_I2C_CLK: JP403.6 ; also sheet 1,2,3
ADDR_I2C_DAT: JP403.5 ; also sheet 1,2,3
DAU_BRD_INT: JP403.4 ; also sheet 1
EN_DTR: JP402.10 ; also sheet 2,3
EN_LORA: JP401.12 ; also sheet 2,3
EN_SD: JP403.3 ; also sheet 2,3
EXT_AD0: JP405.3 ; also sheet 1
EXT_AD1: JP405.4 ; also sheet 1
EXT_AD2: JP404.1 ; also sheet 1
EXT_AD3: JP404.2 ; also sheet 1
EXT_BUS0_GPIO_0/SPI_SCK: JP404.3 ; also sheet 1
EXT_BUS0_GPIO_1: JP404.4 ; also sheet 1
EXT_BUS0_INT: JP404.5 ; also sheet 1
EXT_BUS0_RXD/SPI_MISO/TWCK/PDMIC_DAT: JP404.6 ; also sheet 1
EXT_BUS0_TXD/SPI_MOSI/TWD/PDMIC_CLK: JP404.7 ; also sheet 1
EXT_BUS1_GPIO_0/SPI_SCK: JP404.8 ; also sheet 1
EXT_BUS1_GPIO_1: JP404.9 ; also sheet 1
EXT_BUS1_INT: JP404.10 ; also sheet 1
EXT_BUS1_RXD/SPI_MISO/TWCK: JP404.11 ; also sheet 1
EXT_BUS1_TXD/SPI_MOSI/TWD: JP404.12 ; also sheet 1
EXT_BUS2_GPIO_0/SPI_SCK: JP405.5 ; also sheet 1
EXT_BUS2_GPIO_1: JP405.6 ; also sheet 1
EXT_BUS2_INT: JP405.7 ; also sheet 1
EXT_BUS2_RXD/SPI_MISO/TWCK: JP405.8 ; also sheet 1
EXT_BUS2_TXD/SPI_MOSI/TWD: JP405.9 ; also sheet 1
EXT_SPI_MISO: JP405.10 ; also sheet 1
EXT_SPI_MOSI: JP405.11 ; also sheet 1
EXT_SPI_SCK: JP405.12 ; also sheet 1
GND [10_mil]: JP402.12 ; also sheet 1,2,3
LORA_DIO1: JP401.5 ; also sheet 1,3
LORA_DIO2: JP401.6 ; also sheet 3
LORA_DIO3: JP401.7 ; also sheet 1,3
LORA_RESET: JP401.8 ; also sheet 3
PROC_RESET: JP402.8 ; also sheet 1
RXTX_LORA: JP401.9
SD_DETECT: JP403.8 ; also sheet 1
SPI_CS_LORA: JP401.4 ; also sheet 1,3
SPI_CS_SD: JP403.11 ; also sheet 1
SPI_MISO_LORA: JP401.3 ; also sheet 1,3
SPI_MISO_SD: JP403.9 ; also sheet 1
SPI_MOSI_LORA: JP401.2 ; also sheet 1,3
SPI_MOSI_SD: JP403.10 ; also sheet 1
SPI_SCK_LORA: JP401.1 ; also sheet 1,3
SPI_SCK_SD: JP403.12 ; also sheet 1
USB_D+: JP402.6 ; also sheet 1,2
USB_D-: JP402.7 ; also sheet 1,2
XPAND_WKUP: JP403.7 ; also sheet 1,3
Unconnected: JP402.3 JP402.4 JP402.5 JP405.1 JP405.2

### Buses
LORA:BUSY_LORA,LORA_DIO1,LORA_DIO2,LORA_DIO3,LORA_RESET,RXTX_LORA,SPI_CS_LORA,SPI_MISO_LORA,SPI_MOSI_LORA,SPI_SCK_LORA
SD_CARD:SD_DETECT,SPI_CS_SD,SPI_MISO_SD,SPI_MOSI_SD,SPI_SCK_SD
POWER:3V3,3V3_DTR,3V3_DTR_LOAD,3V3_LORA,3V3_LORA_LOAD,3V3_PROC,3V3_PROC1,3V3_SD,3V3_SD_LOAD,EN_DTR,EN_LORA,EN_SD
EXTERNAL_SERIAL:EXT_BUS0_GPIO_0/SPI_SCK,EXT_BUS0_GPIO_1,EXT_BUS0_INT,EXT_BUS0_RXD/SPI_MISO/TWCK/PDMIC_DAT,EXT_BUS0_TXD/SPI_MOSI/TWD/PDMIC_CLK,EXT_BUS1_GPIO_0/SPI_SCK,EXT_BUS1_GPIO_1,EXT_BUS1_INT,EXT_BUS1_RXD/SPI_MISO/TWCK,EXT_BUS1_TXD/SPI_MOSI/TWD,EXT_BUS2_GPIO_0/SPI_SCK,EXT_BUS2_GPIO_1,EXT_BUS2_INT,EXT_BUS2_RXD/SPI_MISO/TWCK,EXT_BUS2_TXD/SPI_MOSI/TWD,EXT_SPI_MISO,EXT_SPI_MOSI,EXT_SPI_SCK

### Notes on the sheet
- Main and Dtr board power
  Upper left of board
  near pwr subsystem
- External buses for SPI, Flexible interface 1,2
- External analog ports, flexible interface 0
- Debug .1 Inch Pin Ports
- SD Card and Miscellaneous
  Lower side of board by SD
- LORA, Master I2C, & 
  Daughter board interrupt

## Library data of the parts
C101 C103 = Capacitors:C-: Capacitor, Surface Mount; MANUFACTURER: Kemet; MP: CC0402BRNPO9BN5R0; MPN: C0402; TC: X7R; TOL: 10%; VOLTAGE: 6.3V
C102 C104 = Capacitors:C-: Capacitor, Surface Mount; MANUFACTURER: Kemet; MP: CBR04C160F5GAC; MPN: C0402; TC: X7R; TOL: 10%; VOLTAGE: 6.3V
C105 C208 C210 = Capacitors:C-: Capacitor, Surface Mount; MANUFACTURER: Kemet; MP: CC0402KRX5R5BB475; MPN: C0402; TC: X7R; TOL: 10%; VOLTAGE: 6.3V
C106 = Capacitors:C-: Capacitor, Surface Mount; MANUFACTURER: Kemet; MP: GRM155R60J225KE95D; MPN: C0402; TC: X7R; TOL: 10%; VOLTAGE: 6.3V
C107-C114 C202 C215-C217 = Capacitors:C-: Capacitor, Surface Mount; MANUFACTURER: Kemet; MP: CC0402KRX5R5BB104; MPN: C0402; TC: X7R; TOL: 10%; VOLTAGE: 6.3V
C201 = Capacitors:C-: Capacitor, Surface Mount; MANUFACTURER: Kemet; MP: C0603C104K3RACTU; MPN: C0603; TC: X7R; TOL: 10%; VOLTAGE: 6.3V
C203 = Capacitors:C-: Capacitor, Surface Mount; MANUFACTURER: Kemet; MP: C0805C106K9RACTU; MPN: C0805; TC: X7R; TOL: 10%; VOLTAGE: 6.3V
C204 = Capacitors:C-: Capacitor, Surface Mount; MANUFACTURER: Kemet; MP: CC0100KRX5R5BB103; MPN: C0402; TC: X7R; TOL: 10%; VOLTAGE: 6.3V
C205 C207 = Capacitors:C-: Capacitor, Surface Mount; MANUFACTURER: Kemet; MP: CC0402MRX5R4BB106; MPN: C0402; TC: X7R; TOL: 10%; VOLTAGE: 6.3V
C206 = Capacitors:C-: Capacitor, Surface Mount; MANUFACTURER: Kemet; MP: CC0402KRX5R5BB474; MPN: C0402; TC: X7R; TOL: 10%; VOLTAGE: 6.3V
C209 = Capacitors:C-: Capacitor, Surface Mount; MANUFACTURER: Kemet; MP: C0805C225K8RACTU; MPN: C0805; TC: X7R; TOL: 10%; VOLTAGE: 6.3V
C211 = Capacitors:C-: Capacitor, Surface Mount; MANUFACTURER: Kemet; MP: C0805C226K9PAC7800; MPN: C0805; TC: X7R; TOL: 10%; VOLTAGE: 6.3V
C212-C214 = Capacitors:C-: Capacitor, Surface Mount; MANUFACTURER: Kemet; MP: CC0402KRX5R5BB105; MPN: C0402; TC: X7R; TOL: 10%; VOLTAGE: 6.3V
C301 C302 = Capacitors:C-: Capacitor, Surface Mount; MANUFACTURER: Kemet; MP: GCQ1555C1H170JB01D; MPN: C0402; TC: X7R; TOL: 5%; VOLTAGE: 6.3V
C303 = Capacitors:C-: Capacitor, Surface Mount; MANUFACTURER: Kemet; MP: GRM155R71E103KA01D; MPN: C0402; TC: X7R; TOL: 10%; VOLTAGE: 6.3V
C304 = Capacitors:C-: Capacitor, Surface Mount; MANUFACTURER: Kemet; MP: GRM155R71C104KA88D; MPN: C0402; TC: X7R; TOL: 10%; VOLTAGE: 6.3V
C305 = Capacitors:C-: Capacitor, Surface Mount; MANUFACTURER: Kemet; MP: CC0603KRX7R9BB473; MPN: C0603; TC: X7R; TOL: 10%; VOLTAGE: 6.3V
C306 = Capacitors:C-: Capacitor, Surface Mount; MANUFACTURER: Kemet; MP: GRM155R61A474KE15D; MPN: C0402; TC: X7R; TOL: 10%; VOLTAGE: 6.3V
C307 = Capacitors:C-: Capacitor, Surface Mount; MANUFACTURER: Kemet; MP: CC0603BRNPO9BN1R8; MPN: C0603; TC: X7R; TOL: 10%; VOLTAGE: 6.3V
C308 = Capacitors:C-: Capacitor, Surface Mount; MANUFACTURER: Kemet; MP: CC0603FRNPO0BN470; MPN: C0603; TC: X7R; TOL: 10%; VOLTAGE: 6.3V
C309 = Capacitors:C-: Capacitor, Surface Mount; MANUFACTURER: Kemet; MP: AC0603CRNPO9BN3R3; MPN: C0603; TC: X7R; TOL: 10%; VOLTAGE: 6.3V
C310 = Capacitors:C-: Capacitor, Surface Mount; MANUFACTURER: Kemet; MP: CC0603BRNPO9BN8R2; MPN: C0603; TC: X7R; TOL: 10%; VOLTAGE: 6.3V
C311 = Capacitors:C-: Capacitor, Surface Mount; MANUFACTURER: Kemet; MP: CC0603FRNPO9BN390; MPN: C0603; TC: X7R; TOL: 10%; VOLTAGE: 6.3V
C312 = Capacitors:C-: Capacitor, Surface Mount; MANUFACTURER: Kemet; MP: CC0603BRNPO9BN2R4; MPN: C0603; TC: X7R; TOL: 10%; VOLTAGE: 6.3V
C313 = Capacitors:C-: Capacitor, Surface Mount; MANUFACTURER: Kemet; MP: CC0603BRNPO9BN1R0; MPN: C0603; TC: X7R; TOL: 10%; VOLTAGE: 6.3V
C314 = Capacitors:C-: Capacitor, Surface Mount; MANUFACTURER: Kemet; MP: CC0603BRNPO9BN3R0; MPN: C0603; TC: X7R; TOL: 10%; VOLTAGE: 6.3V
C315 = Capacitors:C-: Capacitor, Surface Mount; MANUFACTURER: Kemet; MP: CC0402JRX7R9BB102; MPN: C0402; TC: X7R; TOL: 10%; VOLTAGE: 6.3V
C316 = common_sense:C-: Capacitor, Surface Mount; MP: CC0402JRX7R9BB102; TC: X5R; TOL: 5%; VOLT: 6.3V
CN201 CN202 = adafruit:JST_2PIN: JST 2-Pin Connectors of various flavors SMT-RA (S2B-PH-SM4) 4UConnector #17311 SMT (B2B-PH-SM4) THM-RA (S2B-PH) THM (B2B-PH); MP: S2B-PH-K-S(LF)(SN)
D201 = adafruit:DIODE: Diode SMADIODE - SMA Surface Mount Package 20V 1A Schottky Diode Digikey: 641-1014-6-ND DO-1N4148 - Through Hole Small Current Diode SOD-123 20V 1 A (.5mV Vf) Schottky Diode - Digikey: MBRX120TPMSCT-ND SOD-323 10V 570mA (.38mV Vf, 3ns) Schottky Diode - Digikey: ZLLS410CT-ND SOD-523 30V 30mA Schottky Diode (RB751S-40TE61) - Digikey: RB751S-40TE61CT-ND SOT23-R/W - SOT23 Package (R = Solder Paste/Reflow Ovens, W = Hand-Soldering) BAT54Film 40V 300mA - Digikey: 497-7162-1-ND; MP: MBR120VLSFT3G
F201 = adafruit:PTCFUSE: PTC fuses, resettable thermistors; MP: MF-MSMF050-2
J101 = Debuggers:CORTEX_DEBUG: Cortex Debug Connector - 10 pin Supports JTAG debug, Serial Wire debug, and Serial Wire Viewer. PTH and SMD connector options available. General Connector Information <http://infocenter.arm.com/help/topic/com.arm.doc.faqs/attached/13634/cortex_debug_connectors.pdf> Products: PTH Connector <http://www.digikey.com/product-detail/en/cnc-tech/3220-10-0100-00/1175-1627-ND/3883661> -via Digi-Key SparkFun PSoc <https://www.sparkfun.com/products/13229> SparkFun T <https://www.sparkfun.com/products/13810>; DIGIKEY-NUM: SAM13160TR-ND; MP: FTSH-105-01-F-DV-K-TR; PARTNO: FTSH-105-01-F-DV-K-TR
J102 = Connectors:HIROSE-DF17(4.0)-40DS-0.5V(57): Hirose DF17 Series 0.5mm Pitch 40 Way 2 Row Straight PCB Socket, Surface Mount, Solder Termination Source: Datasheet <https://componentsearchengine.com/Datasheets/1/DF17(4.0)-40DS-0.5V(57).pdf>; DESCRIPTION: Hirose DF17 Series 0.5mm Pitch 40 Way 2 Row Straight PCB Socket, Surface Mount, Solder Termination; HEIGHT: mm; MANUFACTURER_NAME: Hirose; MANUFACTURER_PART_NUMBER: DF17(4.0)-40DS-0.5V(57); MOUSER_PART_NUMBER: 798-DF174040DS05V57; MOUSER_PRICE-STOCK: https://www.mouser.com/Search/Refine.aspx?Keyword=798-DF174040DS05V57; MP: DF17(4.0)-40DS-0.5V(57)
J103 = DM3AT-SF-PEJM5:DM3AT-SF-PEJM5: DM3 Series 8 Position Right Angle SMT Push Push Ejection MicroSD Card Connector; DESCRIPTION: DM3 RA SMT microSD memory card push/push; DIGI-KEY_PART_NUMBER: HR1964CT-ND; DIGI-KEY_PURCHASE_URL: https://www.digikey.com/product-detail/en/hirose-electric-co-ltd/DM3AT-SF-PEJM5/HR1964CT-ND/2533566?utm_source=snapeda&utm_medium=aggregator&utm_campaign=symbol; MF: Hirose; MP: DM3AT-SF-PEJM5; PACKAGE: None
J201 = ZX62D-AB-5P8:USBABSMTDIP; MP: ZX62D-AB-5P8(30)
J202 = Connectors:J-JUMPER: JUMPER; DESCRIPTION: JMP_PROC; MP: TSW-110-14-L-S
J203 = Connectors:J-JUMPER: JUMPER; DESCRIPTION: JMP_LORA; MP: TSW-110-14-L-S
J204 = Connectors:J-JUMPER: JUMPER; DESCRIPTION: JMP_SD; MP: TSW-110-14-L-S
J205 = Connectors:J-JUMPER: JUMPER; DESCRIPTION: DTR_JMP; MP: TSW-110-14-L-S
JP201-JP204 = SparkFun-Jumpers:JUMPER-SMT_3_NO: Normally open jumper This jumper has three pads in close proximity to each other. Apply solder to close the connection(s).
JP301-JP306 = Traffic-Sensor:JUMPER-SMT_2_NO: Normally open jumper This jumper has two pads in close proximity to each other. Apply solder to close the connection. Round pads are easier to solder for beginners, but are a lot larger. SparkFun Product that uses the round pads: SparkFun EL Sequencer <https://www.sparkfun.com/products/12781>
JP401-JP405 = Connectors:J-HEADER-1X12; MP: TSW-110-14-L-S
L201 = Iannucci:L-FE-5X5SMD: TDK VLC-series shielded power inductors; MP: VLCF5028T-100M1R0-2
L202 = SparkFun-Coils:INDUCTOR: Inductors Resist changes in electrical current. Basically a coil of wire. SparkFun Products: SparkFun Load Cell Amplifier - HX711 <https://www.sparkfun.com/products/13879> IOIO-OTG - V2.2 <https://www.sparkfun.com/products/13613>; MP: MLZ2012A3R3WT000; PARTNO: MLZ2012A3R3WT000; PROD_ID: NDUC-13076
L301 = Inductors:L0402; MP: LQW15AN47NJ00D
L302 = Inductors:MLZ2012N150LTD25: FIXED IND 15UH 350MA 611 MOHM. Recommended by Semtech for 15uH component between power pins; DESCRIPTION: Fixed Ind 15uh 350ma 611 Mohm; DIGI-KEY_PART_NUMBER: 445-16377-1-ND; DIGI-KEY_PURCHASE_URL: https://www.digikey.com/product-detail/en/tdk-corporation/MLZ2012N150LTD25/445-16377-1-ND/4766832?utm_source=snapeda&utm_medium=aggregator&utm_campaign=symbol; MF: TDK; MP: MLZ2012N150LTD25; PACKAGE: 0805 TDK
L303 = Inductors:L0603; MP: MLF1608D47NMTA00
L304 = Inductors:L0603; MP: MLG1608B15NJT000
L305 = Inductors:L0603; MP: MLG1608B2N2ST000
L306 = Inductors:L0603; MP: LQW18AN9N1C00D
R101 R106 R301-R304 R307 R309 = SparkFun-Resistors:0OHM: 0Ω resistor A resistor is a passive two-terminal electrical component that implements electrical resistance as a circuit element. Resistors act to reduce current flow, and, at the same time, act to lower voltage levels within circuits. - Wikipedia; MP: RC0603JR-070RL; PROD_ID: RES-08609
R102-R105 R111 R202 R204 = Resistors:R-: Resistor, Surface Mount; MANUFACTURER: Panasonic; MP: RC0402JR-07100KL; MPN: ERJ-; TOL: 5%
R107 R108 = Resistors:R-: Resistor, Surface Mount; MANUFACTURER: Panasonic; MP: CRCW04024K70JNED; MPN: ERJ-; TOL: 5%
R109 = Resistors:R-: Resistor, Surface Mount; MANUFACTURER: Panasonic; MP: RC0402JR-07510KL; MPN: ERJ-; TOL: 5%
R110 R112 = Resistors:R-: Resistor, Surface Mount; MANUFACTURER: Panasonic; MP: RC0402FR-0739RL; MPN: ERJ-; TOL: 5%
R201 = Resistors:R-: Resistor, Surface Mount; MANUFACTURER: Panasonic; MP: RC0402JR-07270KL; MPN: ERJ-; TOL: 5%
R203 = Resistors:R-: Resistor, Surface Mount; MANUFACTURER: Panasonic; MP: RC0402JR-072KL; MPN: ERJ-; TOL: 5%
R205 R207 R208 = varistor:VARISTOR: VARISTOR; MP: CG0603MLC-05E
R206 R209 R305 R311 = Resistors:R-: Resistor, Surface Mount; MANUFACTURER: Panasonic; MP: RC0402JR-0710KL; MPN: ERJ-; TOL: 5%
R210 = Resistors:R-: Resistor, Surface Mount; MANUFACTURER: Panasonic; MP: CRCW06031R33FKEA; MPN: ERJ-; TOL: 5%
R211 R212 = Resistors:R-: Resistor, Surface Mount; MANUFACTURER: Panasonic; MP: RCA06031R00FKEA; MPN: ERJ-; TOL: 5%
R213 = Resistors:R-: Resistor, Surface Mount; MANUFACTURER: Panasonic; MP: RL0603FR-070R5L; MPN: ERJ-; TOL: 5%
R306 = Resistors:R-: Resistor, Surface Mount; MANUFACTURER: Panasonic; MP: RC0402JR-071KL; MPN: ERJ-; TOL: 5%
R308 R310 = SparkFun-Resistors:0OHM: 0Ω resistor A resistor is a passive two-terminal electrical component that implements electrical resistance as a circuit element. Resistors act to reduce current flow, and, at the same time, act to lower voltage levels within circuits. - Wikipedia; DNP: T; PARTNO: *; PROD_ID: RES-08609
S101 S102 = SparkFun-Switches:MOMENTARY-SWITCH-SPST: Momentary Switch (Pushbutton) - SPST Normally-open (NO) SPST momentary switches (buttons, pushbuttons). Variants PTH-12MM - 12mm square, through-hole Momentary Pushbutton Switch - 12mm Square <https://www.sparkfun.com/products/9190> (COM-09190) PTH-6.0MM, PTH-6.0MM-KIT - 6.0mm square, through-hole Mini Pushbutton Switch <https://www.sparkfun.com/products/97> (COM-00097) KIT package intended for soldering kit's - only one side of pads' copper is exposed. PTH-RIGHT-ANGLE-KIT - Right-angle, through-hole Right Angle Tactile Button <https://www.sparkfun.com/products/10791> - Used on SparkFun BigTime Watch Kit <https://www.sparkfun.com/products/11734> SMD-12MM - 12mm square, surface-mount Tactile Button - SMD (12mm) <https://www.sparkfun.com/products/12993> (COM-12993) Used on SparkFun PicoBoard <https://www.sparkfun.com/products/11888> SMD-4.5MM - 4.5mm Square Trackball Switch Used on SparkFun Blackberry Trackballer Breakout <https://www.sparkfun.com/products/13169> SMD-4.6MMX2.8MM - 4.60mm x 2.80mm, surface mount Used on SparkFun SAMD21 Mini Breakout <https://www.sparkfun.com/products/13664> SMD-5.2MM, SMD-5.2-REDUNDANT - 5.2mm square, surface-mount Mini Pushbutton Switch - SMD <https://www.sparkfun.com/products/8720> (COM-08720) Used on Arduino Pro Mini <https://www.sparkfun.com/products/11114> REDUNDANT package connects both switch circuits together SMD-6.0X3.5MM - 6.0 x 3.5mm, surface mount Momentary Reset Switch SMD <https://www.sparkfun.com/products/8229> (COM-08229) SMD-6.2MM-TALL - 6.2mm square, surface mount Tactile Button - SMD (6mm) <https://www.sparkfun.com/products/12992> Used on SparkFun Digital Sandbox <https://www.sparkfun.com/products/12651> SMD-RIGHT-ANGLE - Right-angle, surface mount Used on SparkFun Block for Intel® Edison - Arduino <https://www.sparkfun.com/products/13036>; MP: COM-08720; PROD_ID: SWCH-08247; SF_SKU: COM-08720
S201 = SparkFun-Switches:SWITCH-SPDT: Single Pole, Double Throw (SPDT) Switch Single-pole, double-throw (SPDT) switch. Variant Overview SMD-AYZ0202 Surface Mount DPDT Switch <https://www.sparkfun.com/products/597> (COM-00597) Used on e.g. LilyPad Arduino USB - ATmega32U4 Board <https://www.sparkfun.com/products/12049> PTH-11.6X4.0MM SPDT Mini Power Switch <https://www.sparkfun.com/products/102> (COM-00102) Used on e.g. SparkFun Simon Says - Through-Hole Soldering Kit <https://www.sparkfun.com/products/10547> (KIT-10547) PTH-11.6X4.0MM-KIT KIT version of SPDT Mini Power Switch - Simplifies soldering by removing tStop of switch pins - only one side can be soldered. PTH-11.6X4.0MM-LOCK LOCK version of SPDT Mini Power Switch - Offset pins hold switch in place for easier soldering. SMD-RIGHT-ANGLE Surface Mount Right Angle Switch <https://www.sparkfun.com/products/10860> (COM-10860) Used on e.g. SparkFun ESP8266 Thing <https://www.sparkfun.com/products/13231>; MP: COM-10860; PROD_ID: SWCH-10651; SF_SKU: COM-10860
U101 = Processors:ATSAMG55J19A-AU: MCU 32-bit SAM G ARM Cortex M4 RISC 512KB Flash 1.8V/2.5V/3.3V 64-Pin LQFP Tray; DESCRIPTION: SAMG55 is still under 1st revision _Rev.A_, only see its orderable Sept 15th; DIGI-KEY_PART_NUMBER: ATSAMG55J19A-AU-ND; DIGI-KEY_PURCHASE_URL: https://www.digikey.com/product-detail/en/microchip-technology/ATSAMG55J19A-AU/ATSAMG55J19A-AU-ND/5325413?utm_source=snapeda&utm_medium=aggregator&utm_campaign=symbol; MF: Microchip; MP: ATSAMG55J19A-AU; PACKAGE: LQFP-64 Microchip
U201 = BatteryCharger:U-MCP73871-2CCI/ML; COPYRIGHT: Copyright C 2015 Accelerated Designs. All rights reserved; MANUFACTURER_PART_NUMBER: MCP738712CCIML; MP: MCP738712CCIML; VENDOR: Microchip
U202 = CoulombCounters:COULOMB-MAX17262: 5.2 uA 1-Cell Fuel Gauge with ModelGauge m5 EZ and Internal Current Sensing; MANUFACTURER: Maxim Integrated; MP: MAX17262REWL+T; MPN: MAX17262REWL+T
U203 = Regulators:BUCK-LTC3624EDD-3.3PBF: 17V, 2A Synchronous Step-Down Regulator with 3.5µA Quiescent Current; MANUFACTURER: Linear Technology Corporation; MP: LTC3624EDD3.3#PBF; MPN: LTC3624EDD3.3#PBF
U204-U206 = Switches:LOADSWITCH-MIC9416: MICREL 3A HIGH-SIDE LOAD SWITCH WITH REVERSE BLOCKING http://ww1.microchip.com/downloads/en/DeviceDoc/MIC9416x.pdf https://www.digikey.com/product-detail/en/microchip-technology/MIC94162YCS-TR/576-4508-1-ND/4732487; MANUFACTURER: Microchip Technology; MP: MIC94162YCS-TR; MPN: MIC94162YCS-TR; PARTNO: MIC94162; QUENCH: YES; SOFTSTART: NO
U301 = Radios:SEMTECH_SX1261IMLTRT: Long Range, Low Power, sub-GHz RF Transceiver; CENTROID_NOT_SPECIFIED: No; DATASHEET: https://www.semtech.com/uploads/documents/DS_SX1261-2_V1.1.pdf; DEVICE_CLASS_L1: Integrated Circuits (ICs); DEVICE_CLASS_L2: RF Semiconductors and Devices; DEVICE_CLASS_L3: Transceivers; DIGIKEY_DESCRIPTION: IC TXRX LORA SUB-GHZ 15DBM 24MLPQ; DIGIKEY_PART_NUMBER: SX1261IMLTRTCT-ND; HEIGHT: 1.08mm; INTERFACE: SPI; LEAD_FREE: yes; MAX_FREQUENCY: 960MHz; MAX_SUPPLY_VOLTAGE: 3.7V; MF: Semtech; MFG_PACKAGE_IDENT: QFN24; MFG_PACKAGE_IDENT_DATE: 0; MFG_PACKAGE_IDENT_REV: 0; MIN_SUPPLY_VOLTAGE: 1.8V; MOUSER_PART_NUMBER: 947-SX1261IMLTRT; MP: SX1261IMLTRT; MPN: SX1261IMLTRT; NUMBER_OF_GPIO: 3; PACKAGE: QFN24; PREFIX: U; ROHS: yes; STANDOFF_HEIGHT: 0mm; TEMPERATURE_RANGE_HIGH: +85°C; TEMPERATURE_RANGE_LOW: -40°C; VERIFICATION_VERSION: 0.0.0.1
U302 = Iannucci:U-PE4259; MP: 4259-63
U303 = Expanders:EXPANDER-SX1502: 4/8/16 Channel Low Voltage GPIO with NINT and NRESET; MP: SX1502I087TRT
U304 = ESD:CM1213A-01SO; MP: CM1213A-01SO
X301-X305 = adafruit:ANTENNA_U.FL: U.FL Antenna Connector; MP: 1909763-1
Y101 = common_sense:ABLS2-20.000MHZ-D4Y-T: Crystal 20MHz Ø¢Â±30ppm (Tol) Ø¢Â±30ppm (Stability) 18pF FUND 40Ohm 2-Pin HC-49/US SMD T/R; DESCRIPTION: ABLS2 Series 20.000 MHz ±30 ppm 18 pF -40 to +85 °C SMT Microprocessor Crystal; DIGI-KEY_PART_NUMBER: 535-9879-1-ND; DIGI-KEY_PURCHASE_URL: https://www.digikey.com/product-detail/en/abracon-llc/ABLS2-20.000MHZ-D4Y-T/535-9879-1-ND/2001502; MF: Abracon; MP: ABLS2-20.000MHZ-D4Y-T; PACKAGE: HC49/US Abracon
Y102 = Oscillators:ABS06-32.768KHZ-T: ABS06 Series 32.768 kHz ±10 ppm 9 pF -40 to +85 °C SMT Low Profile Crystal. Footprint verified by Reese Grimsley; DESCRIPTION: ABS06 Series 32.768 kHz ±10 ppm 12.5 pF -40 to +85 °C SMT Low Profile Crystal; DIGI-KEY_PART_NUMBER: 535-10247-1-ND; DIGI-KEY_PURCHASE_URL: https://www.digikey.com/product-detail/en/abracon-llc/ABS06-32.768KHZ-9-1-T/535-10247-1-ND/2218060; MF: Abracon; MP: ABS06-32.768KHZ-9-1-T; PACKAGE: SMD-2 Abracon
Y301 = Oscillators:ECS-32MHZ_CKM_XTAL: 32 MHz crystal with load capacitance of 20pF, ESR 40. Selected model +-10ppm, -20 to 70 C temperature rated. Part added by Reese Grimsley; DIGI-KEY_PART_NUMBER: XC1819CT-ND; DIGI-KEY_PURCHASE_URL: https://www.digikey.com/product-detail/en/ECS-320-20-33-CKM-TR/XC1819CT-ND/2781944?utm_campaign=buynow&WT.z_cid=ref_octopart_dkc_buynow&utm_medium=aggregator&curr=usd&site=us&utm_source=octopart; MP: ECS-320-20-33-CKM-TR; PARTNO: ECS-320-20-33-CKM-TR

## Net classes
1 power_3v3: width 0.305 mm
2 power_5: width 0.305 mm
3 50_ohm: width 0.279 mm
4 power_bat: width 0.305 mm
5 10_mil: width 0.254 mm